# EAGLE design Wii U display tap (EAGLE 6.6.0)
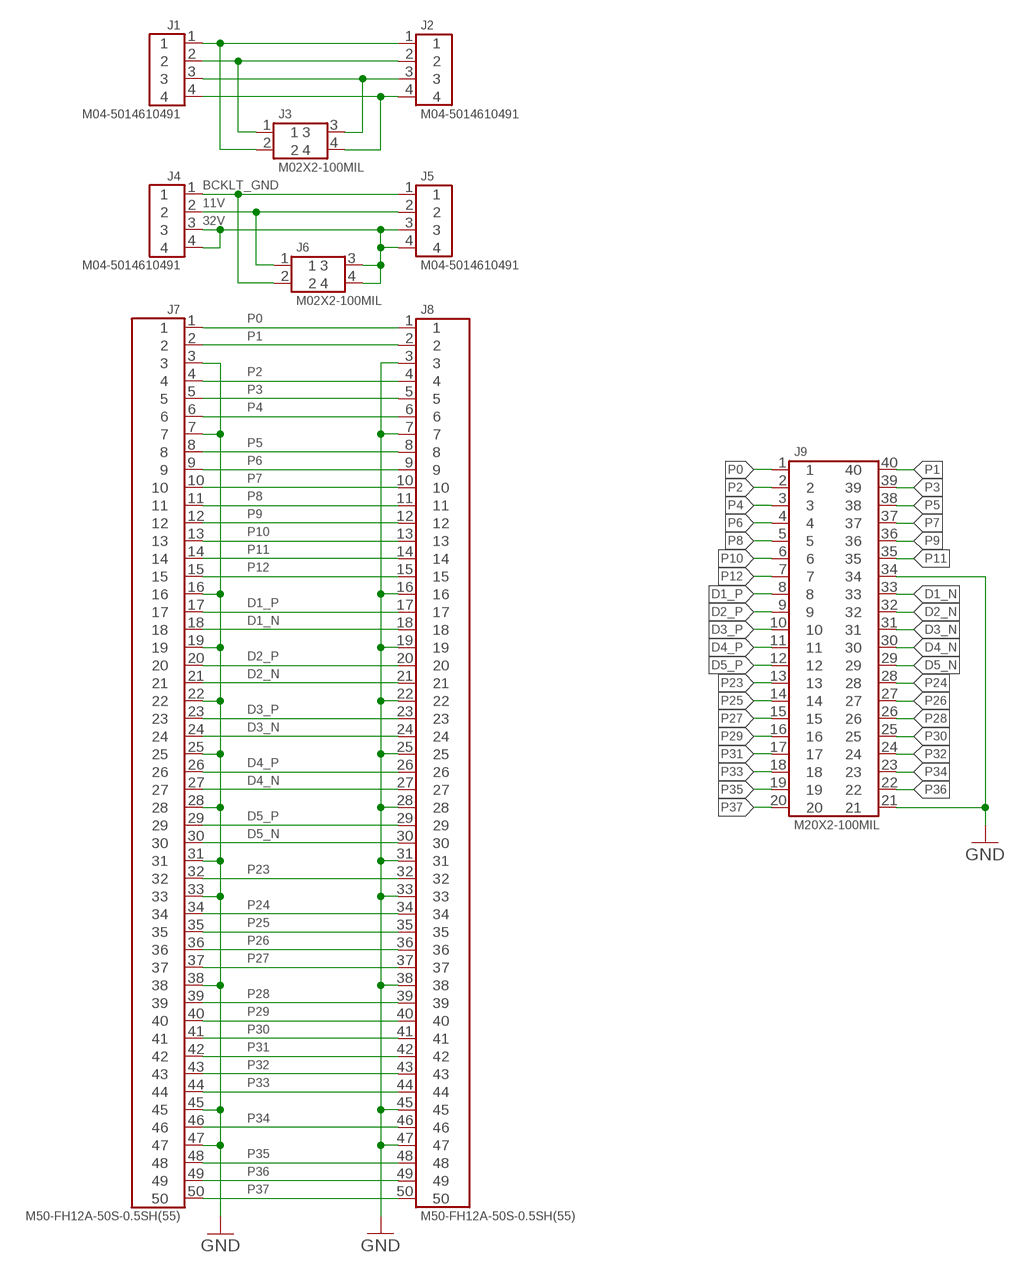
[diagram p0: schematic, sheet 1]

## Parts
J1  M04-5014610491  [5014610491]
J2  M04-5014610491  [5014610491]
J3  M02X2-100MIL  [M02X2-100MIL]
J4  M04-5014610491  [5014610491]
J5  M04-5014610491  [5014610491]
J6  M02X2-100MIL  [M02X2-100MIL]
J7  M50-FH12A-50S-0.5SH(55)  [FH12A-50S-0.5SH(55)]
J8  M50-FH12A-50S-0.5SH(55)  [FH12A-50S-0.5SH(55)]
J9  M20X2-100MIL  [M20X2-100MIL]

## Nets
11V: J4.2 J5.2 J6.1
32V: J4.3 J4.4 J5.3 J5.4 J6.3 J6.4
BCKLT_GND: J4.1 J5.1 J6.2
D1_N: J7.18 J8.18 J9.33
D1_P: J7.17 J8.17 J9.8
D2_N: J7.21 J8.21 J9.32
D2_P: J7.20 J8.20 J9.9
D3_N: J7.24 J8.24 J9.31
D3_P: J7.23 J8.23 J9.10
D4_N: J7.27 J8.27 J9.30
D4_P: J7.26 J8.26 J9.11
D5_N: J7.30 J8.30 J9.29
D5_P: J7.29 J8.29 J9.12
GND: J7.3 J7.7 J7.16 J7.19 J7.22 J7.25 J7.28 J7.31 J7.33 J7.38 J7.45 J7.47 J8.3 J8.7 J8.16 J8.19 J8.22 J8.25 J8.28 J8.31 J8.33 J8.38 J8.45 J8.47 J9.21 J9.34
N$3: J1.3 J2.3 J3.3
N$4: J1.4 J2.4 J3.4
N$5: J1.2 J2.2 J3.1
N$6: J1.1 J2.1 J3.2
P0: J7.1 J8.1 J9.1
P1: J7.2 J8.2 J9.40
P2: J7.4 J8.4 J9.2
P3: J7.5 J8.5 J9.39
P4: J7.6 J8.6 J9.3
P5: J7.8 J8.8 J9.38
P6: J7.9 J8.9 J9.4
P7: J7.10 J8.10 J9.37
P8: J7.11 J8.11 J9.5
P9: J7.12 J8.12 J9.36
P10: J7.13 J8.13 J9.6
P11: J7.14 J8.14 J9.35
P12: J7.15 J8.15 J9.7
P23: J7.32 J8.32 J9.13
P24: J7.34 J8.34 J9.28
P25: J7.35 J8.35 J9.14
P26: J7.36 J8.36 J9.27
P27: J7.37 J8.37 J9.15
P28: J7.39 J8.39 J9.26
P29: J7.40 J8.40 J9.16
P30: J7.41 J8.41 J9.25
P31: J7.42 J8.42 J9.17
P32: J7.43 J8.43 J9.24
P33: J7.44 J8.44 J9.18
P34: J7.46 J8.46 J9.23
P35: J7.48 J8.48 J9.19
P36: J7.49 J8.49 J9.22
P37: J7.50 J8.50 J9.20

## Library data of the parts
J1 J2 J4 J5 = Connectors:M04
J3 J6 = Connectors:M02X2
J7 J8 = Connectors:M50
J9 = Connectors:M20X2

## Board
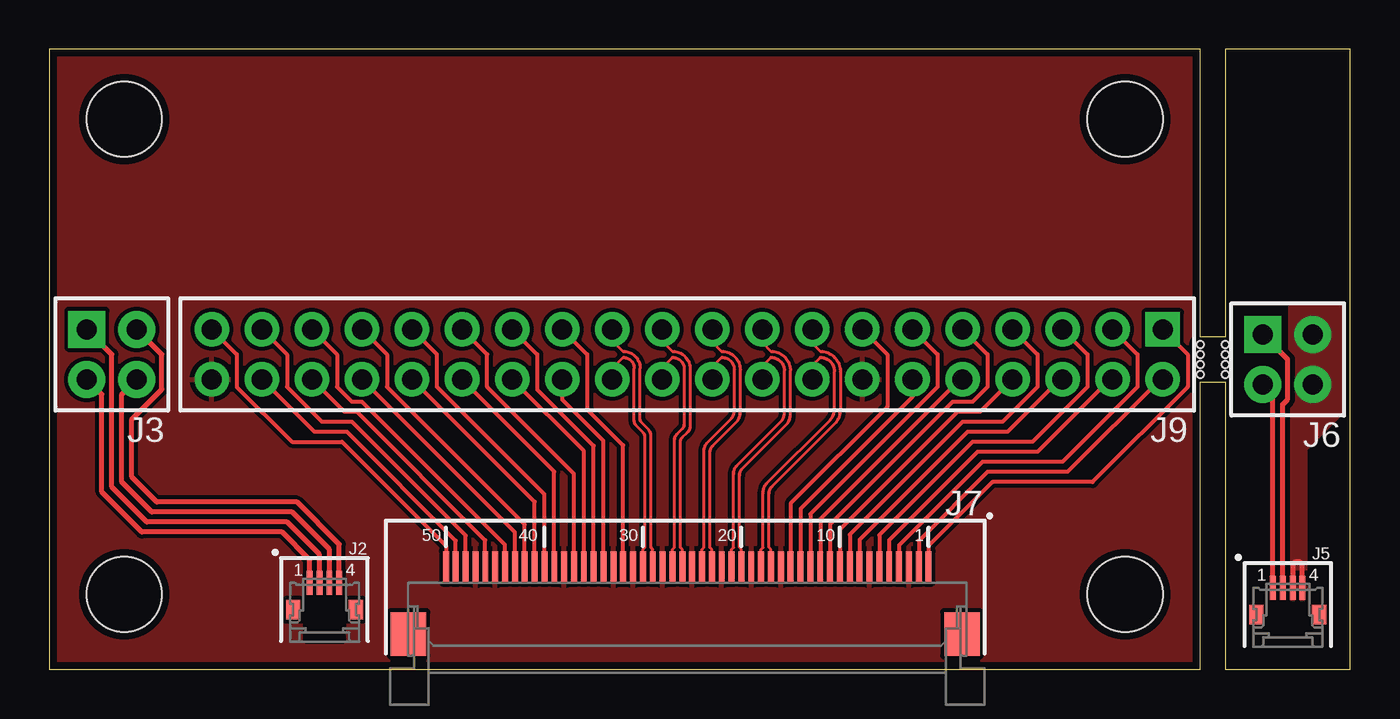
[diagram p1: board, top side]
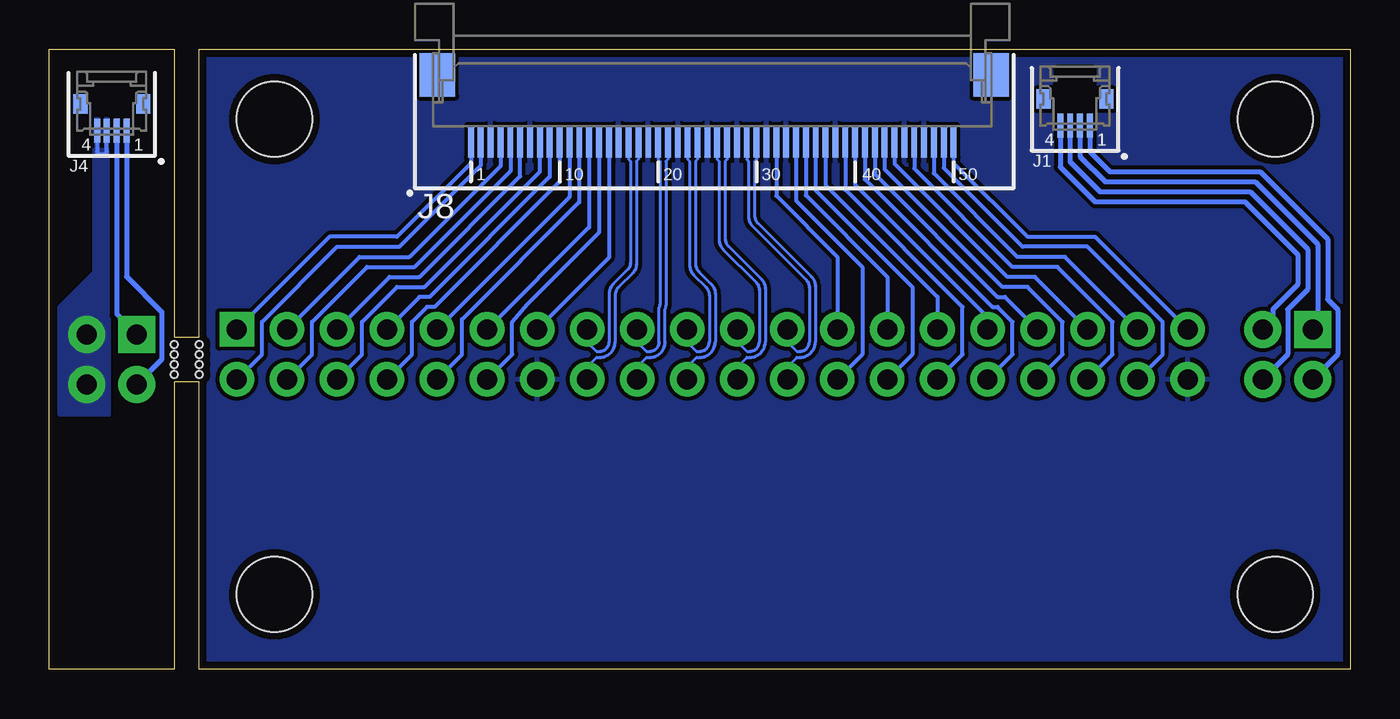
[diagram p2: board, bottom side, seen from below]

Size 66.04 x 31.5 mm. Coordinates in mm from the lower left corner, seen from the top.
Outline: 0,0 58.42,0 58.42,14.61 59.69,14.61 59.69,0 66.04,0 66.04,31.5 59.69,31.5 59.69,16.89 58.42,16.89 58.42,31.5 0,31.5 0,0
Copper layers (1*16): Top 0.0356mm / dielectric 1.5011mm / Bottom 0.0356mm
Design rules "oshpark-2layer": minimum track width 6mil, minimum drill 13mil, track to track 6mil, track to pad 6mil, pad to pad 6mil, via to via 6mil, smd to smd 6mil, copper to edge 15mil, drill to drill 6mil, minimum pad ring 7mil, minimum via ring 7mil, stop-mask expansion 2.5mil, vias tented up to drill 0mil, thermal gap 10mil
Holes 3.81 mm at 3.81,27.94 54.61,27.94 54.61,3.81 3.81,3.81
Holes 0.36 mm at 59.69,16.51 59.69,16 59.69,15.49 59.69,14.99 58.42,16.51 58.42,16 58.42,15.49 58.42,14.99

### Footprints (pad centres in the part's own frame; a part is rotated, then mirrored left to right if it is on the bottom)
5014610491 = smd 0.3 x 1.21: 1 0.75,-2.995; 2 0.25,-2.995; 3 -0.25,-2.995; 4 -0.75,-2.995 | smd 0.72 x 1: P$1 1.59,-1.64; P$2 -1.59,-1.64
M02X2-100MIL = drill 1.016 pad 1.88 square: 1 -1.27,-1.27 | drill 1.016 pad 1.88: 2 1.27,-1.27; 3 1.27,1.27; 4 -1.27,1.27
FH12A-50S-0.5SH(55) = smd 0.3 x 1.6: 1 -12.25,0; 2 -11.75,0; 3 -11.25,0; 4 -10.75,0; 5 -10.25,0; 6 -9.75,0; 7 -9.25,0; 8 -8.75,0; 9 -8.25,0; 10 -7.75,0; 11 -7.25,0; 12 -6.75,0; 13 -6.25,0; 14 -5.75,0; 15 -5.25,0; 16 -4.75,0; 17 -4.25,0; 18 -3.75,0; 19 -3.25,0; 20 -2.75,0; 21 -2.25,0; 22 -1.75,0; 23 -1.25,0; 24 -0.75,0; 25 -0.25,0; 26 0.25,0; 27 0.75,0; 28 1.25,0; 29 1.75,0; 30 2.25,0; 31 2.75,0; 32 3.25,0; 33 3.75,0; 34 4.25,0; 35 4.75,0; 36 5.25,0; 37 5.75,0; 38 6.25,0; 39 6.75,0; 40 7.25,0; 41 7.75,0; 42 8.25,0; 43 8.75,0; 44 9.25,0; 45 9.75,0; 46 10.25,0; 47 10.75,0; 48 11.25,0; 49 11.75,0; 50 12.25,0 | smd 1.8 x 2.2: P$1 14.15,3.4; P$2 -13.95,3.4
M20X2-100MIL = drill 1.016 pad 1.753 square: 1 -24.13,-1.27 | drill 1.016 pad 1.753: 2 -21.59,-1.27; 3 -19.05,-1.27; 4 -16.51,-1.27; 5 -13.97,-1.27; 6 -11.43,-1.27; 7 -8.89,-1.27; 8 -6.35,-1.27; 9 -3.81,-1.27; 10 -1.27,-1.27; 11 1.27,-1.27; 12 3.81,-1.27; 13 6.35,-1.27; 14 8.89,-1.27; 15 11.43,-1.27; 16 13.97,-1.27; 17 16.51,-1.27; 18 19.05,-1.27; 19 21.59,-1.27; 20 24.13,-1.27; 21 24.13,1.27; 22 21.59,1.27; 23 19.05,1.27; 24 16.51,1.27; 25 13.97,1.27; 26 11.43,1.27; 27 8.89,1.27; 28 6.35,1.27; 29 3.81,1.27; 30 1.27,1.27; 31 -1.27,1.27; 32 -3.81,1.27; 33 -6.35,1.27; 34 -8.89,1.27; 35 -11.43,1.27; 36 -13.97,1.27; 37 -16.51,1.27; 38 -19.05,1.27; 39 -21.59,1.27; 40 -24.13,1.27

### Placement (x,y rotation side)
J1  13.97,30.61 0 bottom
J2  13.97,1.4 180 top
J3  3.17,16 270 top
J4  62.87,30.35 0 bottom
J5  62.87,1.14 180 top
J6  62.87,15.75 270 top
J7  32.38,5.21 180 top
J8  32.38,26.8 0 bottom
J9  32.38,16 180 top

### Tracks (layer width: path | path; a pad name or v marks a point on that pad's centre or on a via)
11V
  Top 0.254: J5.2 62.62,13.47 62.87,13.72 62.87,15.75 J6.1
  Bottom 0.254: J4.2 62.62,18.04 J6.1
32V
  Top 0.254: J5.4 63.62,5.35 63.5,5.46 63.25,5.46 63.12,5.33 63.12,4.32
  Bottom 0.203: J4.4 63.62,26.28 63.5,26.16 63.25,26.16 63.12,26.29 63.12,27.3
  pour Top (isolate 0.254): 62.99,3.56 62.99,18.41 65.53,18.41 65.53,12.95 63.75,11.18 63.75,3.56
  pour Bottom (isolate 0.254): 65.53,12.95 62.99,12.95 62.99,27.94 63.75,27.94 63.75,20.19 65.53,18.41
  pour Top (isolate 0.254, no thermals): 62.99,12.95 62.99,18.41 65.53,18.41 65.53,12.95
  pour Bottom (isolate 0.254, no thermals): 62.99,12.95 62.99,18.41 65.53,18.41 65.53,12.95
BCKLT_GND
  Top 0.254: J5.1 62.12,13.96 J6.2
  Bottom 0.254: J4.1 62.12,19.95 60.33,18.16 60.33,15.75 J6.2
D1_N
  Top 0.152: J7.18 36.13,6.09 36.23,6.19 36.23,8.95 arc-45 36.46,9.49 39.65,12.68 arc45 39.85,13.18 39.85,15.13 arc90 39.13,15.85 38.73,15.45 J9.33
  Bottom 0.152: J9.33 38.73,15.37 38.25,15.85 38.1,15.85 arc-90 37.31,16.64 37.31,19 arc45 37.15,19.41 36.42,20.14 arc-45 36.23,20.58 36.23,25.81 36.13,25.91 J8.18
D1_P
  Top 0.152: J7.17 36.63,6.09 36.54,6.19 36.54,8.93 arc-45 36.69,9.29 39.88,12.48 arc45 40.16,13.16 40.16,15.13 arc90 39.13,16.15 38.73,16.55 J9.8
  Bottom 0.152: J9.8 38.73,16.64 38.25,16.15 38.1,16.15 arc-90 37.62,16.64 37.62,19.08 arc45 37.41,19.57 36.69,20.3 arc-45 36.54,20.66 36.54,25.81 36.63,25.91 J8.17
D2_N
  Top 0.152: J9.32 36.2,15.41 36.63,15.85 arc-90 37.31,15.17 37.31,13 arc-45 37.14,12.59 34.93,10.38 arc45 34.73,9.91 34.73,6.19 34.63,6.09 J7.21
  Bottom 0.152: J9.32 36.2,15.37 35.71,15.85 35.56,15.85 arc-90 34.77,16.64 34.77,18.31 34.73,18.5 34.73,25.81 34.63,25.91 J8.21
D2_P
  Top 0.152: J9.9 36.2,16.59 36.63,16.15 arc-90 37.62,15.17 37.62,12.93 arc-45 37.41,12.43 35.19,10.21 arc45 35.04,9.84 35.04,6.19 35.13,6.09 J7.20
  Bottom 0.152: J9.9 36.2,16.64 35.71,16.15 35.56,16.15 arc-90 35.08,16.64 35.08,18.39 35.04,18.55 35.04,25.81 35.13,25.91 J8.20
D3_N
  Top 0.152: J9.31 33.66,15.37 34.13,15.85 arc-90 34.77,15.21 34.77,13.13 arc-45 34.6,12.72 33.43,11.55 arc45 33.23,11.07 33.23,6.19 33.13,6.09 J7.24
  Bottom 0.152: J9.31 33.66,15.37 33.17,15.85 33.02,15.85 arc-90 32.23,16.64 32.23,19.07 arc-45 32.44,19.58 33.06,20.19 arc45 33.23,20.61 33.23,25.81 33.13,25.91 J8.24
D3_P
  Top 0.152: J9.10 33.66,16.63 34.13,16.15 arc-90 35.08,15.21 35.08,13.05 arc-45 34.87,12.56 33.7,11.39 arc45 33.54,10.99 33.54,6.19 33.63,6.09 J7.23
  Bottom 0.152: J9.10 33.66,16.64 33.17,16.15 33.02,16.15 arc-90 32.54,16.64 32.54,19 arc-45 32.7,19.41 33.33,20.03 arc45 33.54,20.54 33.54,25.81 33.63,25.91 J8.23
D4_N
  Top 0.152: J9.30 31.11,15.33 31.64,15.85 arc-90 32.23,15.25 32.23,12.43 arc-45 32.15,12.23 31.87,11.95 arc45 31.73,11.62 31.73,6.19 31.64,6.09 J7.27
  Bottom 0.152: J9.30 31.11,15.37 30.63,15.85 30.48,15.85 arc-90 29.69,16.64 29.69,19.33 arc-45 29.9,19.83 31.56,21.49 arc45 31.73,21.9 31.73,25.81 31.64,25.91 J8.27
D4_P
  Top 0.152: J9.11 31.11,16.67 31.64,16.15 arc-90 32.54,15.25 32.54,12.4 arc-45 32.39,12.04 32.12,11.77 arc45 32.04,11.57 32.04,6.19 32.13,6.09 J7.26
  Bottom 0.152: J9.11 31.11,16.64 30.63,16.15 30.48,16.15 arc-90 30,16.64 30,19.26 arc-45 30.16,19.66 31.84,21.33 arc45 32.04,21.82 32.04,25.81 32.13,25.91 J8.26
D5_N
  Top 0.152: J9.29 28.57,15.29 29.14,15.85 arc-90 29.69,15.29 29.69,12.64 arc45 29.8,12.37 30.16,12.01 arc-45 30.23,11.84 30.23,6.19 30.14,6.09 J7.30
  Bottom 0.152: J9.29 28.57,15.37 28.09,15.85 27.94,15.85 arc-90 27.15,16.64 27.15,19.46 arc-45 27.36,19.95 30.07,22.66 arc45 30.23,23.06 30.23,25.81 30.14,25.91 J8.30
D5_P
  Top 0.152: J9.12 28.57,16.71 29.14,16.15 arc-90 30,15.29 30,12.67 arc45 30.04,12.56 30.42,12.19 arc-45 30.54,11.9 30.54,6.19 30.64,6.09 J7.29
  Bottom 0.152: J9.12 28.57,16.64 28.09,16.15 27.94,16.15 arc-90 27.46,16.64 27.46,19.39 arc-45 27.62,19.79 30.34,22.51 arc45 30.54,22.98 30.54,25.81 30.64,25.91 J8.29
GND
  pour Top (isolate 0.203): -0.64,31.75 -0.64,-0.64 58.42,-0.64 58.42,31.75
  pour Bottom (isolate 0.203): -1.27,32.38 -1.27,-1.27 58.42,-1.27 58.42,32.38
N$3
  Top 0.254: J3.3 3.68,13.97 3.68,9.53 5.21,8 12.32,8 14.22,6.1 J2.3
  Bottom 0.254: J3.3 3.17,16 3.17,18.29 2.16,19.3 2.16,21.34 5.08,24.26 12.7,24.26 14.22,25.78 J1.3
N$4
  Top 0.254: J3.4 5.71,16 5.71,14.22 4.19,12.7 4.19,9.78 5.46,8.51 12.57,8.51 14.72,6.36 J2.4
  Bottom 0.254: J3.4 3.92,17.79 3.92,18.28 2.67,19.54 2.67,21.07 5.35,23.75 12.95,23.75 14.72,25.52 J1.4
N$5
  Top 0.254: J3.1 3.17,16 3.17,9.28 4.96,7.49 12.06,7.49 13.72,5.84 J2.2
  Bottom 0.254: J1.2 13.72,26.05 12.44,24.77 4.83,24.77 1.65,21.59 1.65,17.53 J3.1
N$6
  Top 0.254: J3.2 2.67,13.97 2.67,9.02 4.7,6.99 11.81,6.99 13.22,5.58 J2.1
  Bottom 0.254: J3.2 0.64,16 0.64,18.29 1.14,18.8 1.14,21.84 4.57,25.27 12.19,25.27 13.22,26.3 J1.1
P0
  Top 0.203: J9.1 57.78,16 57.78,14.35 52.96,9.53 47.88,9.53 44.63,6.28 J7.1
  Bottom 0.203: J8.1 44.63,25.72 48.39,21.97 51.82,21.97 J9.1
P1
  Top 0.203: J9.40 56.39,14.73 51.69,10.03 47.62,10.03 44.13,6.54 J7.2
  Bottom 0.203: J9.40 55.24,16 55.24,17.65 51.44,21.46 48.26,21.46 44.13,25.59 J8.2
P2
  Top 0.203: J9.2 55.24,16 55.24,14.35 51.44,10.54 47.37,10.54 43.13,6.3 J7.4
  Bottom 0.203: J9.2 50.29,20.95 47.75,20.95 43.13,25.57 J8.4
P3
  Top 0.203: J9.39 53.85,14.73 50.16,11.05 47.12,11.05 42.63,6.57 J7.5
  Bottom 0.203: J9.39 52.7,16 52.7,17.65 49.91,20.45 47.5,20.45 42.63,25.31 J8.5
P4
  Top 0.203: J9.3 52.7,16 52.7,14.35 49.91,11.56 46.86,11.56 42.13,6.83 J7.6
  Bottom 0.203: J9.3 48.77,19.94 47.24,19.94 42.13,25.05 J8.6
P5
  Top 0.203: J9.38 51.31,14.73 48.64,12.06 46.61,12.06 41.13,6.59 J7.8
  Bottom 0.203: J9.38 50.16,16 50.16,17.65 48.38,19.43 46.99,19.43 41.13,25.29 J8.8
P6
  Top 0.203: J9.4 50.16,16 50.16,14.35 48.39,12.57 46.35,12.57 40.63,6.85 J7.9
  Bottom 0.203: J8.9 40.63,25.02 46.73,18.92 47.24,18.92 J9.4
P7
  Top 0.203: J9.37 47.24,13.08 46.1,13.08 40.13,7.12 J7.10
  Bottom 0.203: J9.37 47.62,16 47.62,17.65 46.86,18.41 46.48,18.41 40.13,24.77 J8.10
P8
  Top 0.203: J9.5 47.62,16 47.62,14.35 46.86,13.59 45.85,13.59 39.63,7.38 J7.11
  Bottom 0.203: J8.11 39.63,23.99 J9.5
P9
  Top 0.203: J9.36 46.23,14.73 39.13,7.64 J7.12
  Bottom 0.203: J9.36 45.09,16 45.09,17.78 39.13,23.73 J8.12
P10
  Top 0.203: J9.6 45.09,16 45.09,14.35 38.63,7.9 J7.13
  Bottom 0.203: J8.13 38.63,22.45 J9.6
P11
  Top 0.203: J9.35 43.81,13.84 38.13,8.16 J7.14
  Bottom 0.203: J9.35 42.55,16 42.55,17.65 41.78,18.54 38.13,22.19 J8.14
P12
  Top 0.203: J9.7 42.55,16 42.55,13.34 37.63,8.43 J7.15
  Bottom 0.203: J8.15 37.63,20.91 J9.7
P23
  Top 0.203: J9.13 27.3,16 27.3,13.21 29.14,11.38 J7.32
  Bottom 0.203: J8.32 29.14,24.05 26.04,20.95 J9.13
P24
  Top 0.203: J9.28 26.04,13.72 28.14,11.62 J7.34
  Bottom 0.203: J9.28 24.77,16 24.77,20.45 28.14,23.82 J8.34
P25
  Top 0.203: J9.14 24.77,16 24.77,14.22 27.64,11.35 J7.35
  Bottom 0.203: J8.35 27.64,24.08 23.5,19.94 J9.14
P26
  Top 0.203: J7.36 27.14,11.09 J9.27
  Bottom 0.203: J9.27 22.23,16 22.23,19.43 27.14,24.34 J8.36
P27
  Top 0.203: J9.15 22.23,16 22.23,14.35 26.64,9.94 J7.37
  Bottom 0.203: J8.37 26.64,24.6 20.95,18.92 J9.15
P28
  Top 0.203: J7.39 25.64,10.05 J9.26
  Bottom 0.203: J9.26 19.68,16 19.68,18.41 25.64,24.36 J8.39
P29
  Top 0.203: J9.16 19.68,16 19.68,14.35 25.14,8.9 J7.40
  Bottom 0.203: J8.40 25.14,24.63 18.41,17.91 J9.16
P30
  Top 0.203: J7.41 24.64,8.51 J9.25
  Bottom 0.203: J9.25 17.14,16 17.14,17.65 17.91,18.41 18.16,18.41 24.64,24.89 J8.41
P31
  Top 0.203: J9.17 17.14,16 17.14,14.35 24.14,7.36 J7.42
  Bottom 0.203: J8.42 24.14,25.15 17.91,18.92 17.53,18.92 J9.17
P32
  Top 0.203: J7.43 23.64,6.97 J9.24
  Bottom 0.203: J9.24 14.61,16 14.61,17.65 16.39,19.43 17.65,19.43 23.64,25.41 J8.43
P33
  Top 0.203: J9.18 14.61,16 14.61,14.35 15.37,13.59 15.88,13.59 23.14,6.33 J7.44
  Bottom 0.203: J9.18 16,19.94 17.4,19.94 23.14,25.68 J8.44
P34
  Top 0.203: J7.46 22.14,6.57 15.62,13.08 14.99,13.08 J9.23
  Bottom 0.203: J9.23 12.06,16 12.06,17.65 14.86,20.45 17.14,20.45 22.14,25.44 J8.46
P35
  Top 0.203: J9.19 12.06,16 12.06,14.35 13.84,12.57 15.37,12.57 21.14,6.8 J7.48
  Bottom 0.203: J9.19 14.48,20.95 16.89,20.95 21.14,25.2 J8.48
P36
  Top 0.203: J7.49 20.64,6.54 15.11,12.06 13.46,12.06 J9.22
  Bottom 0.203: J9.22 9.53,16 9.53,17.65 13.34,21.46 16.64,21.46 20.64,25.46 J8.49
P37
  Top 0.203: J9.20 9.53,16 9.53,14.35 12.32,11.56 14.86,11.56 20.14,6.28 J7.50
  Bottom 0.203: J8.50 20.14,25.72 16.38,21.97 12.95,21.97 J9.20